# EAGLE design L3G4200D (EAGLE 5.11)
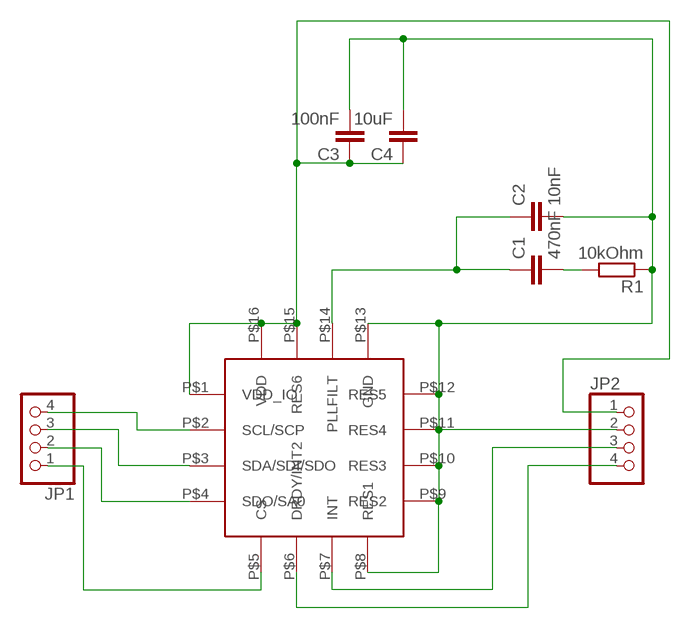
[diagram p0: schematic, sheet 1]

## Parts
C1  470nF  C-EUC1206  [C1206]
C2  10nF  C-EUC1206  [C1206]
C3  100nF  C-EUC1206  [C1206]
C4  10uF  C-EUC1206  [C1206]
JP1  PINHD-1X4  [1X04]
JP2  PINHD-1X4  [1X04]
R1  10kOhm  R-EU_R1206  [R1206]
U$1  L3G4200D  [LGA16]

## Nets
CS: JP1.1 U$1.P$5(CS)
DR: JP2.4 U$1.P$6(DRDY/INT2)
GND: C2.2 C3.2 C4.2 JP2.2 R1.1 U$1.P$8(RES1) U$1.P$9(RES2) U$1.P$10(RES3) U$1.P$11(RES4) U$1.P$12(RES5) U$1.P$13(GND)
INT: JP2.3 U$1.P$7(INT)
N$9: C1.2 R1.2
PLLFLT: C1.1 C2.1 U$1.P$14(PLLFILT)
SA0: JP1.2 U$1.P$4(SDO/SA0)
SCL: JP1.4 U$1.P$2(SCL/SCP)
SDA: JP1.3 U$1.P$3(SDA/SDI/SDO)
VDD: C3.1 C4.1 JP2.1 U$1.P$1(VDD_IO) U$1.P$15(RES6) U$1.P$16(VDD)

## Library data of the parts
C1-C4 = rcl:C-EU: CAPACITOR, European symbol
JP1 JP2 = pinhead:PINHD-1X4: PIN HEADER
R1 = rcl:R-EU_: RESISTOR, European symbol
U$1 = st-microelectronics:L3G4200D

## Net classes
0 default: width 0.254 mm, drill 0.254 mm, clearance 0.254 mm

## Board
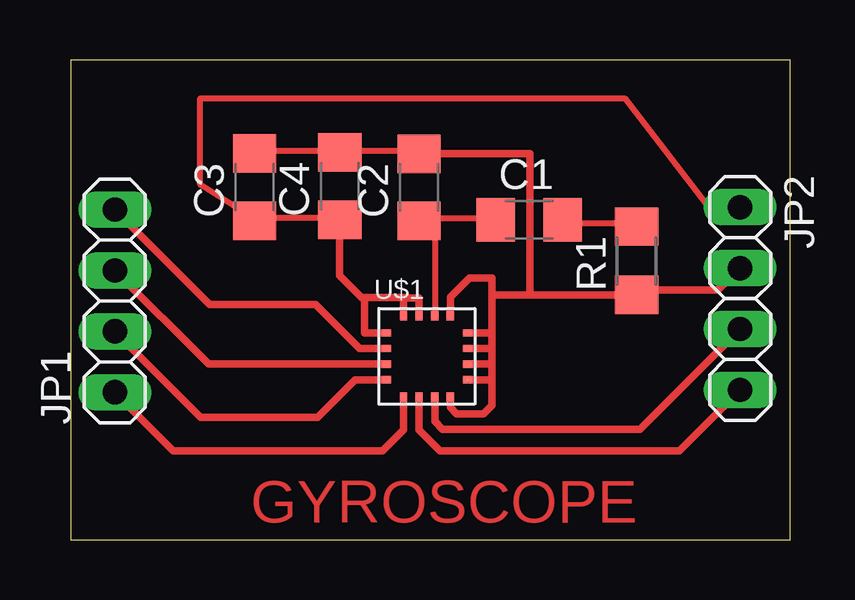
[diagram p1: board, top side]

Size 30 x 20 mm. Coordinates in mm from the lower left corner, seen from the top.
Outline: 0,0 30,0 30,20 0,20 0,0
Copper layers (1*16): Top 0.035mm / dielectric 1.5mm / Bottom 0.035mm
Design rules "default": minimum track width 10mil, minimum drill 24mil, track to track 8mil, track to pad 8mil, pad to pad 8mil, via to via 8mil, smd to smd 8mil, copper to edge 40mil, drill to drill 8mil, minimum pad ring 10mil, minimum via ring 8mil, stop-mask expansion 4mil, vias tented up to drill 0mil, thermal gap 10mil

### Footprints (pad centres in the part's own frame; a part is rotated, then mirrored left to right if it is on the bottom)
C1206 = smd 1.6 x 1.8: 1 -1.4,0; 2 1.4,0
1X04 = drill 1.016 long: 1 -3.81,0; 2 -1.27,0; 3 1.27,0; 4 3.81,0
R1206 = smd 1.6 x 1.803: 1 -1.422,0; 2 1.422,0
LGA16 = smd 0.4 x 0.3: P$1 0.3,2.975; P$2 0.3,2.325; P$3 0.3,1.675; P$4 0.3,1.025; P$9 3.7,1.025; P$10 3.7,1.675; P$11 3.7,2.325; P$12 3.7,2.975 | smd 0.3 x 0.4: P$5 1.025,0.3; P$6 1.675,0.3; P$7 2.325,0.3; P$8 2.975,0.3; P$13 2.975,3.7; P$14 2.325,3.7; P$15 1.675,3.7; P$16 1.025,3.7

### Placement (x,y rotation side)
C1  19.12,13.33 0 top
C2  14.52,14.69 90 top
C3  7.67,14.7 90 top
C4  11.22,14.74 90 top
JP1  1.84,9.95 90 top
JP2  27.91,10.05 270 top
R1  23.59,11.63 90 top
U$1  12.85,5.64 0 top

### Tracks (layer width: path | path; a pad name or v marks a point on that pad's centre or on a via)
CS
  Top 0.305: U$1.P$5 13.88,4.58 13,3.7 4.28,3.7 JP1.1
DR
  Top 0.305: U$1.P$6 14.53,4.58 15.4,3.7 25.37,3.7 JP2.4
GND  (1 unrouted)
  Top 0.254: C3.2 7.8,16.2 11.2,16.2 C4.2 11.4,16.2 14.4,16.2 C2.2 | R1.1 23.6,10.4
  Top 0.305: 23.6,10.4 26.99,10.4 JP2.2 | U$1.P$12 17.57,8.62 17.57,8.61 | 17.57,7.32 17.57,7.96 | 17.56,6.66 17.57,6.65 17.57,7.32 | U$1.P$8 15.82,5.5 16.09,5.24 17.21,5.24 17.57,5.6 17.57,6.63 17.56,6.66 | U$1.P$13 15.82,10.12 16.62,10.91 17.57,10.91 17.57,10.21 | 17.57,10.21 19.15,10.21 | 19.15,10.21 R1.1 | 17.57,8.61 17.57,10.21 | C2.2 19.15,16.09 19.15,10.21 | 17.57,7.96 U$1.P$11 | 17.57,7.96 17.57,8.61 | 17.57,7.32 U$1.P$10 | 16.57,6.66 17.56,6.66
INT
  Top 0.305: JP2.3 23.73,4.6 15.5,4.6 15.18,4.92 U$1.P$7
N$9
  Top 0.254: C1.2 20.6,13.2 23.4,13.2 R1.2
PLLFLT
  Top 0.254: U$1.P$14 15.2,9.4 15.2,12.6 14.6,13.2 C2.1 14.6,13.4 17.6,13.4 C1.1
SA0
  Top 0.305: U$1.P$4 11.87,6.67 10.3,5.1 5.42,5.1 JP1.2
SCL
  Top 0.254: 13.04,7.97 U$1.P$2
  Top 0.305: 13.04,7.97 12.04,7.97 10.2,9.8 5.8,9.8 JP1.4
SDA
  Top 0.305: U$1.P$3 5.75,7.32 JP1.3
VDD
  Top 0.254: C4.1 11.2,13.4 7.8,13.4 C3.1 7.6,13.4 5.4,14.8 5.4,18.4 23.1,18.4 26.5,14 27.8,14 JP2.1
  Top 0.305: U$1.P$15 14.53,10.08 13.89,10.08 13.89,10.09 13.88,10.09 | 13.88,10.09 U$1.P$16 | 12.26,10.09 12.13,10.09 12.13,10.1 11.22,11.01 C4.1 | 12.26,10.09 13.88,10.09 | U$1.P$1 12.26,8.62 12.26,10.09

### Text on the board
Top: GYROSCOPE